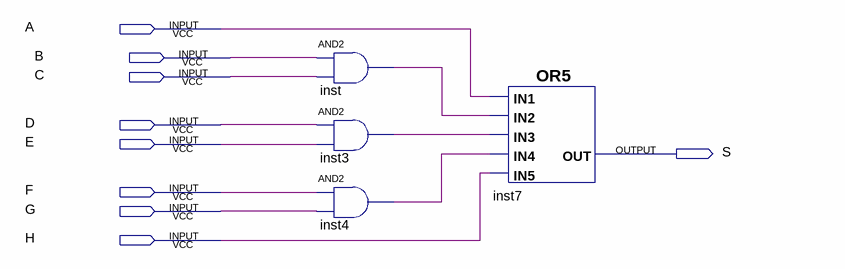
[diagram p0: schematic sheet]
// Quartus schematic misc_3.bdf as structural Verilog: 4 symbols, 9 pins
module misc_3 (
  input  A,
  input  B,
  input  C,
  input  D,
  input  E,
  input  F,
  input  G,
  input  H,
  output S
);

  wire inst3_out, inst4_out, inst_out;

  and inst (inst_out, B, C);
  and inst3 (inst3_out, D, E);
  and inst4 (inst4_out, F, G);
  or inst7 (S, A, inst_out, inst3_out, inst4_out, H);
endmodule
